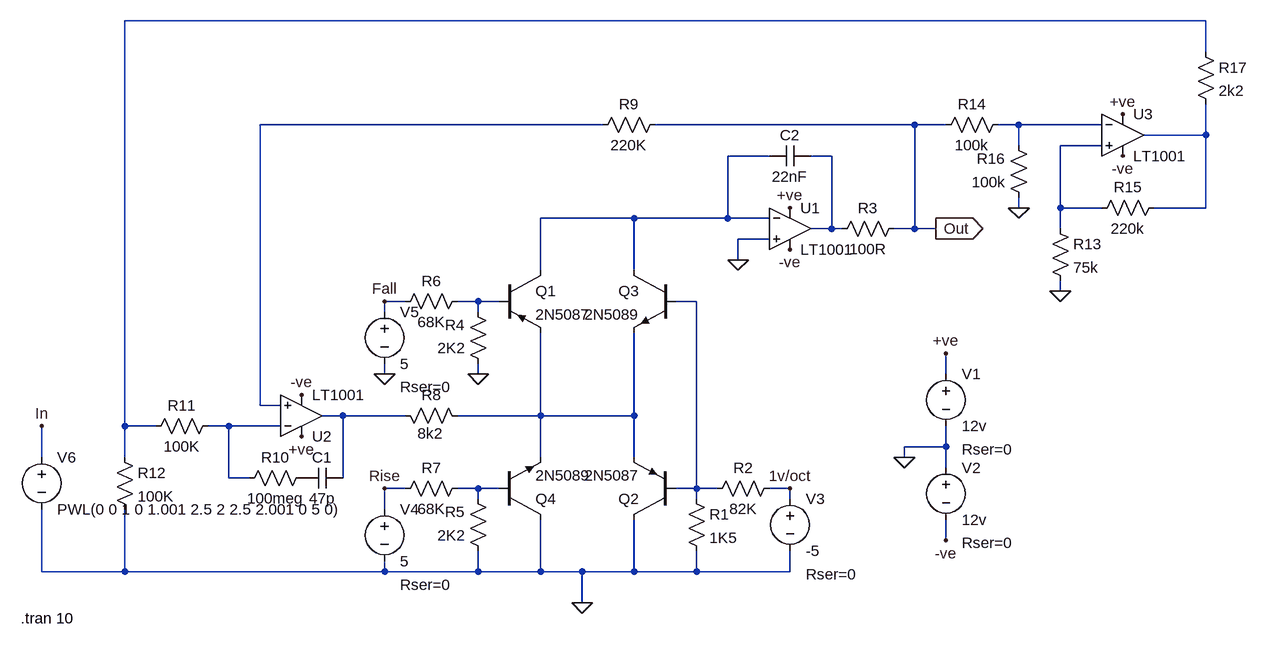
[diagram p0: schematic DUSG%20osc.asc]
DUSG%20osc.asc, the LTspice schematic file:
Version 4
SHEET 1 1256 680
WIRE 1184 -384 -480 -384
WIRE 1184 -336 1184 -384
WIRE 256 -224 -272 -224
WIRE 736 -224 336 -224
WIRE 784 -224 736 -224
WIRE 896 -224 864 -224
WIRE 1024 -224 896 -224
WIRE 1184 -208 1184 -256
WIRE 1184 -208 1088 -208
WIRE 896 -192 896 -224
WIRE 1024 -192 960 -192
WIRE 512 -176 448 -176
WIRE 608 -176 576 -176
WIRE 896 -96 896 -112
WIRE 960 -96 960 -192
WIRE 1024 -96 960 -96
WIRE 1184 -96 1184 -208
WIRE 1184 -96 1104 -96
WIRE 304 -80 160 -80
WIRE 448 -80 448 -176
WIRE 448 -80 304 -80
WIRE 512 -80 448 -80
WIRE 608 -64 608 -176
WIRE 608 -64 576 -64
WIRE 624 -64 608 -64
WIRE 736 -64 736 -224
WIRE 736 -64 704 -64
WIRE 768 -64 736 -64
WIRE 960 -64 960 -96
WIRE 512 -48 464 -48
WIRE 464 -16 464 -48
WIRE 160 0 160 -80
WIRE 304 0 304 -80
WIRE 960 32 960 16
WIRE -48 48 -80 48
WIRE 64 48 32 48
WIRE 96 48 64 48
WIRE 400 48 368 48
WIRE -80 64 -80 48
WIRE 64 64 64 48
WIRE -80 160 -80 144
WIRE 64 160 64 144
WIRE 784 160 784 128
WIRE -272 208 -272 -224
WIRE -240 208 -272 208
WIRE -144 224 -176 224
WIRE -48 224 -144 224
WIRE 160 224 160 96
WIRE 160 224 32 224
WIRE 304 224 304 96
WIRE 304 224 160 224
WIRE -480 240 -480 -384
WIRE -432 240 -480 240
WIRE -320 240 -352 240
WIRE -240 240 -320 240
WIRE 784 272 784 240
WIRE 784 272 720 272
WIRE -608 288 -608 240
WIRE -480 288 -480 240
WIRE 160 288 160 224
WIRE 304 288 304 224
WIRE 720 288 720 272
WIRE 784 304 784 272
WIRE -320 320 -320 240
WIRE -288 320 -320 320
WIRE -144 320 -144 224
WIRE -48 336 -80 336
WIRE 64 336 32 336
WIRE 96 336 64 336
WIRE 400 336 400 48
WIRE 400 336 368 336
WIRE 432 336 400 336
WIRE 544 336 512 336
WIRE 64 352 64 336
WIRE 400 352 400 336
WIRE 544 352 544 336
WIRE -80 368 -80 336
WIRE 784 416 784 384
WIRE -608 464 -608 368
WIRE -480 464 -480 368
WIRE -480 464 -608 464
WIRE -80 464 -80 448
WIRE -80 464 -480 464
WIRE 64 464 64 432
WIRE 64 464 -80 464
WIRE 160 464 160 384
WIRE 160 464 64 464
WIRE 224 464 160 464
WIRE 304 464 304 384
WIRE 304 464 224 464
WIRE 400 464 400 432
WIRE 400 464 304 464
WIRE 544 464 544 432
WIRE 544 464 400 464
WIRE 224 512 224 464
FLAG 464 -16 0
FLAG 64 160 0
FLAG 224 512 0
FLAG 768 -64 Out
IOPIN 768 -64 Out
FLAG 544 336 1v/oct
FLAG -80 160 0
FLAG -80 48 Fall
FLAG -80 336 Rise
FLAG 720 288 0
FLAG -608 240 In
FLAG 784 128 +ve
FLAG 544 -96 +ve
FLAG -208 256 +ve
FLAG 784 416 -ve
FLAG 544 -32 -ve
FLAG -208 192 -ve
FLAG 1056 -240 +ve
FLAG 1056 -176 -ve
FLAG 960 32 0
FLAG 896 -96 0
SYMBOL pnp 96 0 R0
SYMATTR InstName Q1
SYMATTR Value 2N5087
SYMBOL pnp 368 384 R180
SYMATTR InstName Q2
SYMATTR Value 2N5087
SYMBOL npn 368 0 M0
SYMATTR InstName Q3
SYMATTR Value 2N5089
SYMBOL npn 96 384 M180
SYMATTR InstName Q4
SYMATTR Value 2N5089
SYMBOL res 384 336 R0
SYMATTR InstName R1
SYMATTR Value 1K5
SYMBOL res 528 320 R90
WINDOW 0 0 56 VBottom 0
WINDOW 3 32 56 VTop 0
SYMATTR InstName R2
SYMATTR Value 82K
SYMBOL Opamps\\LT1001 544 -128 R0
SYMATTR InstName U1
SYMBOL res 720 -80 R90
WINDOW 0 0 56 VBottom 0
WINDOW 3 32 56 VTop 0
SYMATTR InstName R3
SYMATTR Value 100R
SYMBOL res 80 160 R180
WINDOW 0 36 76 Left 0
WINDOW 3 36 40 Left 0
SYMATTR InstName R4
SYMATTR Value 2K2
SYMBOL res 80 448 R180
WINDOW 0 36 76 Left 0
WINDOW 3 36 40 Left 0
SYMATTR InstName R5
SYMATTR Value 2K2
SYMBOL res -64 64 R270
WINDOW 0 32 56 VTop 0
WINDOW 3 0 56 VBottom 0
SYMATTR InstName R6
SYMATTR Value 68K
SYMBOL res -64 352 R270
WINDOW 0 32 56 VTop 0
WINDOW 3 0 56 VBottom 0
SYMATTR InstName R7
SYMATTR Value 68K
SYMBOL res -64 208 M90
WINDOW 0 0 56 VBottom 0
WINDOW 3 28 54 VTop 0
SYMATTR InstName R8
SYMATTR Value 8k2
SYMBOL voltage 784 144 R0
WINDOW 123 0 0 Left 0
WINDOW 39 24 132 Left 0
SYMATTR SpiceLine Rser=0
SYMATTR InstName V1
SYMATTR Value 12v
SYMBOL voltage 784 288 R0
WINDOW 123 0 0 Left 0
WINDOW 39 24 132 Left 0
SYMATTR SpiceLine Rser=0
SYMATTR InstName V2
SYMATTR Value 12v
SYMBOL voltage 544 336 R0
WINDOW 123 0 0 Left 0
WINDOW 39 24 132 Left 0
SYMATTR SpiceLine Rser=0
SYMATTR InstName V3
SYMATTR Value -5
SYMBOL voltage -80 352 R0
WINDOW 123 0 0 Left 0
WINDOW 39 24 132 Left 0
SYMATTR SpiceLine Rser=0
SYMATTR InstName V4
SYMATTR Value 5
SYMBOL voltage -80 48 R0
WINDOW 123 0 0 Left 0
WINDOW 39 24 132 Left 0
SYMATTR SpiceLine Rser=0
SYMATTR InstName V5
SYMATTR Value 5
SYMBOL voltage -608 272 R0
WINDOW 123 0 0 Left 0
WINDOW 39 0 0 Left 0
SYMATTR InstName V6
SYMATTR Value PWL(0 0 1 0 1.001 2.5 2 2.5 2.001 0 5 0)
SYMBOL Opamps\\LT1001 -208 288 M180
SYMATTR InstName U2
SYMBOL res 352 -240 R90
WINDOW 0 0 56 VBottom 0
WINDOW 3 32 56 VTop 0
SYMATTR InstName R9
SYMATTR Value 220K
SYMBOL res -192 304 R90
WINDOW 0 0 56 VBottom 0
WINDOW 3 32 56 VTop 0
SYMATTR InstName R10
SYMATTR Value 100meg
SYMBOL res -336 224 R90
WINDOW 0 0 56 VBottom 0
WINDOW 3 32 56 VTop 0
SYMATTR InstName R11
SYMATTR Value 100K
SYMBOL cap -144 304 R90
WINDOW 0 0 32 VBottom 0
WINDOW 3 32 32 VTop 0
SYMATTR InstName C1
SYMATTR Value 47p
SYMBOL cap 576 -192 R90
WINDOW 0 0 32 VBottom 0
WINDOW 3 32 32 VTop 0
SYMATTR InstName C2
SYMATTR Value 22nF
SYMBOL res -496 272 R0
SYMATTR InstName R12
SYMATTR Value 100K
SYMBOL Opamps\\LT1001 1056 -272 R0
SYMATTR InstName U3
SYMBOL res 944 -80 R0
SYMATTR InstName R13
SYMATTR Value 75k
SYMBOL res 880 -240 R90
WINDOW 0 0 56 VBottom 0
WINDOW 3 32 56 VTop 0
SYMATTR InstName R14
SYMATTR Value 100k
SYMBOL res 1120 -112 R90
WINDOW 0 0 56 VBottom 0
WINDOW 3 32 56 VTop 0
SYMATTR InstName R15
SYMATTR Value 220k
SYMBOL res 912 -96 R180
WINDOW 0 36 76 Left 0
WINDOW 3 36 40 Left 0
SYMATTR InstName R16
SYMATTR Value 100k
SYMBOL res 1168 -352 R0
SYMATTR InstName R17
SYMATTR Value 2k2
TEXT -640 536 Left 0 !.tran 10

The netlist it stands for:
* DUSG%20osc.asc
Q1 N006 N008 N011 0 2N5087
Q2 0 N009 N011 0 2N5087
Q3 N006 N009 N011 0 2N5089
Q4 0 N013 N011 0 2N5089
R1 N009 0 1K5
R2 1v/oct N009 82K
XU1 0 N006 +ve -ve N007 LT1001  ; pins In+ In- V+ V- OUT
R3 Out N007 100R
R4 0 N008 2K2
R5 0 N013 2K2
R6 Fall N008 68K
R7 Rise N013 68K
R8 N010 N011 8k2
V1 +ve 0 12v Rser=0
V2 0 -ve 12v Rser=0
V3 1v/oct 0 -5 Rser=0
V4 Rise 0 5 Rser=0
V5 Fall 0 5 Rser=0
V6 In 0 PWL(0 0 1 0 1.001 2.5 2 2.5 2.001 0 5 0)
XU2 N002 N012 +ve -ve N010 LT1001  ; pins In+ In- V+ V- OUT
R9 Out N002 220K
R10 P001 N012 100meg
R11 N012 N001 100K
C1 N010 P001 47p
C2 N007 N006 22nF
R12 N001 0 100K
XU3 N005 N003 +ve -ve N004 LT1001  ; pins In+ In- V+ V- OUT
R13 N005 0 75k
R14 N003 Out 100k
R15 N004 N005 220k
R16 0 N003 100k
R17 N001 N004 2k2
.model NPN NPN
.model PNP PNP
.lib standard.bjt
.tran 10
.lib LTC.lib
.backanno
.end

* Results of the author's LTspice run, read from the files saved beside the schematic
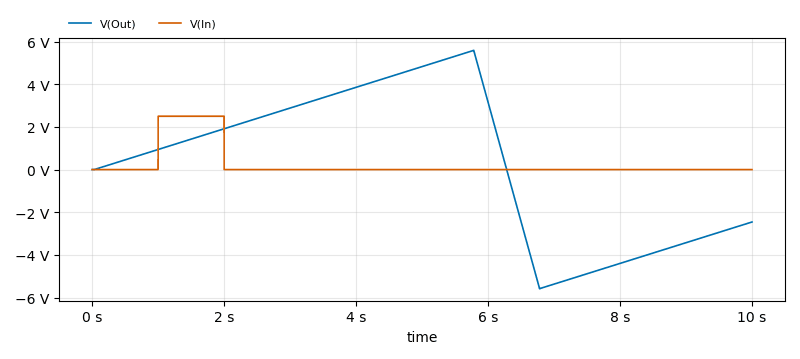
[diagram p1: Transient Analysis of DUSG%20osc.asc, plotted from the saved traces]
* Transient Analysis, 1 run:
*   V(Out): min -5.591 V, max 5.59 V, average 313.2 mV, rms 3.827 V, last -2.458 V
*   V(In): min 0 V, max 2.5 V, average 250 mV, rms 790.6 mV, last 0 V